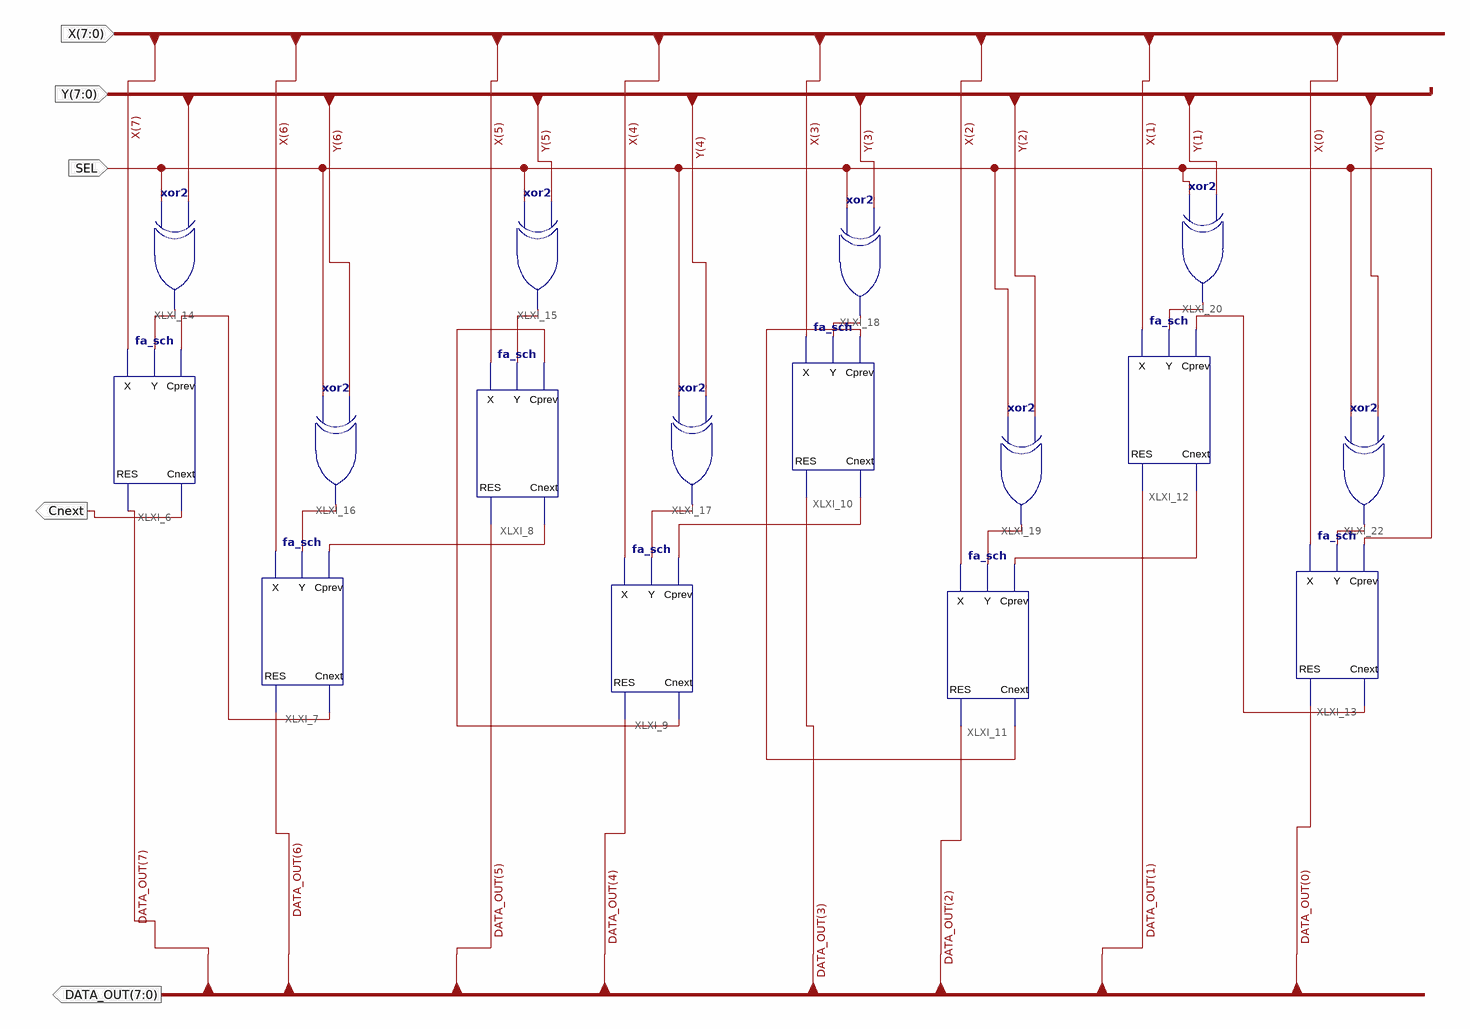
[diagram p0: schematic sheet 1]
// Xilinx ISE schematic alu_sch.sch (spartan3e) as structural Verilog: 16 symbols, 5 ports
module alu_sch (
  input  [7:0] X,
  input  SEL,
  input  [7:0] Y,
  output Cnext,
  output [7:0] DATA_OUT
);

  wire XLXN_27, XLXN_28, XLXN_29, XLXN_30, XLXN_31, XLXN_32, XLXN_33, XLXN_34, XLXN_44, XLXN_46, XLXN_47,
       XLXN_48, XLXN_49, XLXN_50, XLXN_52;

  fa_sch XLXI_6 (.Cprev(XLXN_52), .Y(XLXN_27), .X(X[7]), .Cnext(Cnext), .RES(DATA_OUT[7]));
  fa_sch XLXI_7 (.Cprev(XLXN_50), .Y(XLXN_28), .X(X[6]), .Cnext(XLXN_52), .RES(DATA_OUT[6]));
  fa_sch XLXI_8 (.Cprev(XLXN_49), .Y(XLXN_29), .X(X[5]), .Cnext(XLXN_50), .RES(DATA_OUT[5]));
  fa_sch XLXI_9 (.Cprev(XLXN_48), .Y(XLXN_30), .X(X[4]), .Cnext(XLXN_49), .RES(DATA_OUT[4]));
  fa_sch XLXI_10 (.Cprev(XLXN_47), .Y(XLXN_31), .X(X[3]), .Cnext(XLXN_48), .RES(DATA_OUT[3]));
  fa_sch XLXI_11 (.Cprev(XLXN_46), .Y(XLXN_32), .X(X[2]), .Cnext(XLXN_47), .RES(DATA_OUT[2]));
  fa_sch XLXI_12 (.Cprev(XLXN_44), .Y(XLXN_33), .X(X[1]), .Cnext(XLXN_46), .RES(DATA_OUT[1]));
  fa_sch XLXI_13 (.Cprev(SEL), .Y(XLXN_34), .X(X[0]), .Cnext(XLXN_44), .RES(DATA_OUT[0]));
  xor XLXI_14 (XLXN_27, SEL, Y[7]);
  xor XLXI_15 (XLXN_29, SEL, Y[5]);
  xor XLXI_16 (XLXN_28, SEL, Y[6]);
  xor XLXI_17 (XLXN_30, SEL, Y[4]);
  xor XLXI_18 (XLXN_31, SEL, Y[3]);
  xor XLXI_19 (XLXN_32, SEL, Y[2]);
  xor XLXI_20 (XLXN_33, SEL, Y[1]);
  xor XLXI_22 (XLXN_34, SEL, Y[0]);
endmodule
